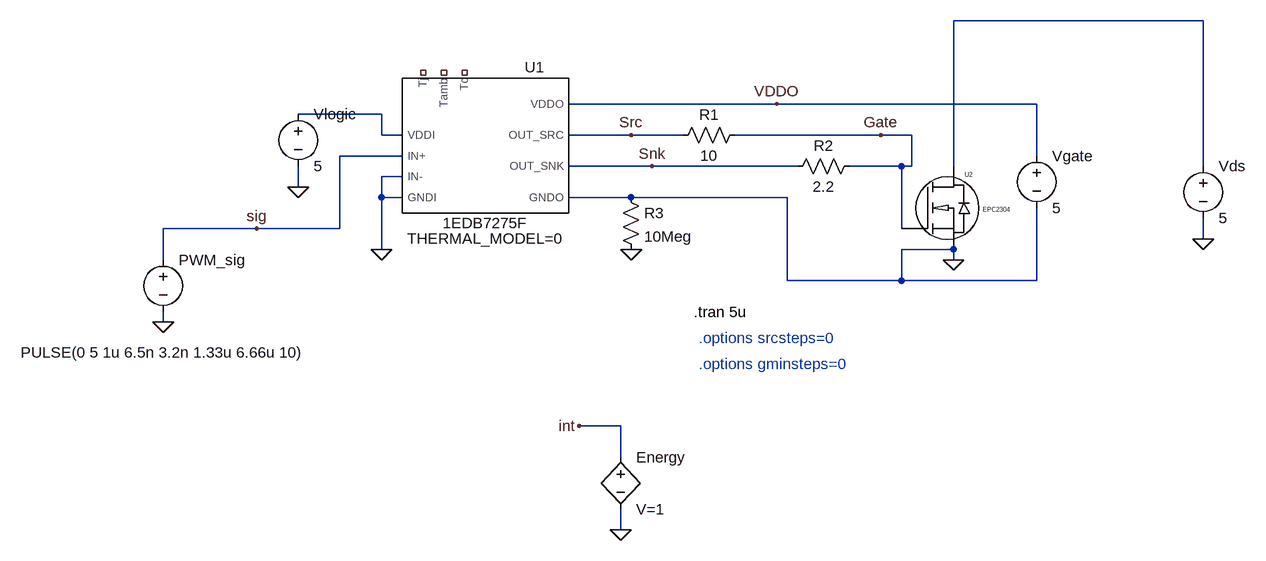
[diagram p0: schematic GaN_driver_power_consumption.asc]
GaN_driver_power_consumption.asc, the LTspice schematic file:
Version 4.1
SHEET 1 1304 816
WIRE 1232 -16 848 -16
WIRE 576 112 256 112
WIRE 976 112 576 112
WIRE -32 128 -160 128
WIRE -32 160 -32 128
WIRE 0 160 -32 160
WIRE 352 160 256 160
WIRE 432 160 352 160
WIRE 736 160 512 160
WIRE 784 160 736 160
WIRE 0 192 -96 192
WIRE 976 192 976 112
WIRE 384 208 256 208
WIRE 608 208 384 208
WIRE 768 208 688 208
WIRE 784 208 784 160
WIRE 784 208 768 208
WIRE 848 208 848 -16
WIRE 1232 208 1232 -16
WIRE 0 224 -32 224
WIRE -160 240 -160 208
WIRE -32 256 -32 224
WIRE 0 256 -32 256
WIRE 352 256 256 256
WIRE 592 256 352 256
WIRE -224 304 -368 304
WIRE -96 304 -96 192
WIRE -96 304 -224 304
WIRE 768 304 768 208
WIRE 1232 320 1232 288
WIRE -32 336 -32 256
WIRE 848 336 768 336
WIRE -368 352 -368 304
WIRE 848 352 848 336
WIRE 592 384 592 256
WIRE 768 384 768 336
WIRE 768 384 592 384
WIRE 976 384 976 272
WIRE 976 384 768 384
WIRE -368 448 -368 432
WIRE 336 608 272 608
WIRE 336 656 336 608
WIRE 336 768 336 736
FLAG -160 240 0
FLAG -368 448 0
FLAG -32 336 0
FLAG 352 336 0
FLAG 736 160 Gate
FLAG 352 160 Src
FLAG 384 208 Snk
FLAG -224 304 sig
FLAG 848 352 0
FLAG 1232 320 0
FLAG 336 768 0
FLAG 576 112 VDDO
FLAG 272 608 int
SYMBOL voltage -160 112 R0
WINDOW 123 0 0 Left 0
WINDOW 39 0 0 Left 0
SYMATTR InstName Vlogic
SYMATTR Value 5
SYMBOL voltage -368 336 R0
WINDOW 3 -219 159 Left 2
WINDOW 123 0 0 Left 0
WINDOW 39 0 0 Left 0
SYMATTR Value PULSE(0 5 1u 6.5n 3.2n 1.33u 6.66u 10)
SYMATTR InstName PWM_sig
SYMBOL voltage 976 176 R0
WINDOW 123 0 0 Left 0
WINDOW 39 0 0 Left 0
SYMATTR InstName Vgate
SYMATTR Value 5
SYMBOL res 528 144 R90
WINDOW 0 0 56 VBottom 2
WINDOW 3 32 56 VTop 2
SYMATTR InstName R1
SYMATTR Value 10
SYMBOL res 704 192 R90
WINDOW 0 0 56 VBottom 2
WINDOW 3 32 56 VTop 2
SYMATTR InstName R2
SYMATTR Value 2.2
SYMBOL 1EDB7275F 128 176 R0
SYMATTR InstName U1
SYMATTR SpiceLine THERMAL_MODEL=0
SYMBOL res 336 240 R0
SYMATTR InstName R3
SYMATTR Value 10Meg
SYMBOL EPCGaN 768 304 R0
SYMATTR InstName U2
SYMBOL voltage 1232 192 R0
SYMATTR InstName Vds
SYMATTR Value 5
SYMBOL bv 336 640 R0
SYMATTR InstName Energy
SYMATTR Value V=1
TEXT 448 432 Left 2 !.tran 5u
TEXT 456 472 Left 2 ;.options srcsteps=0
TEXT 456 512 Left 2 ;.options gminsteps=0

The netlist it stands for:
* GaN_driver_power_consumption.asc
Vlogic N002 0 5
V§PWM_sig sig 0 PULSE(0 5 1u 6.5n 3.2n 1.33u 6.66u 10)
Vgate VDDO 0 5
R1 Gate Src 10
R2 Gate Snk 2.2
X§U1 Src VDDO sig 0 N002 NC_01 NC_02 NC_03 0 Snk 0 1EDB7275F THERMAL_MODEL=0  ; pins OUT_SRC VDDO IN+ GNDI VDDI Tj Tamb Tc IN- OUT_SNK GNDO
R3 0 0 10Meg
X§U2 Gate N001 0 EPC2304  ; pins gatein drainin N_0
Vds N001 0 5
B§Energy int 0 V=1
.tran 5u
* .options srcsteps=0
* .options gminsteps=0
.lib 1EDB7275F.lib
.lib EPCGanlibrary.lib
.backanno
.end